# Altium schematic sheet Sensors_Power_Characterisation_Board.SchDoc
size A4; SheetNumber: 1; SheetTotal: 5
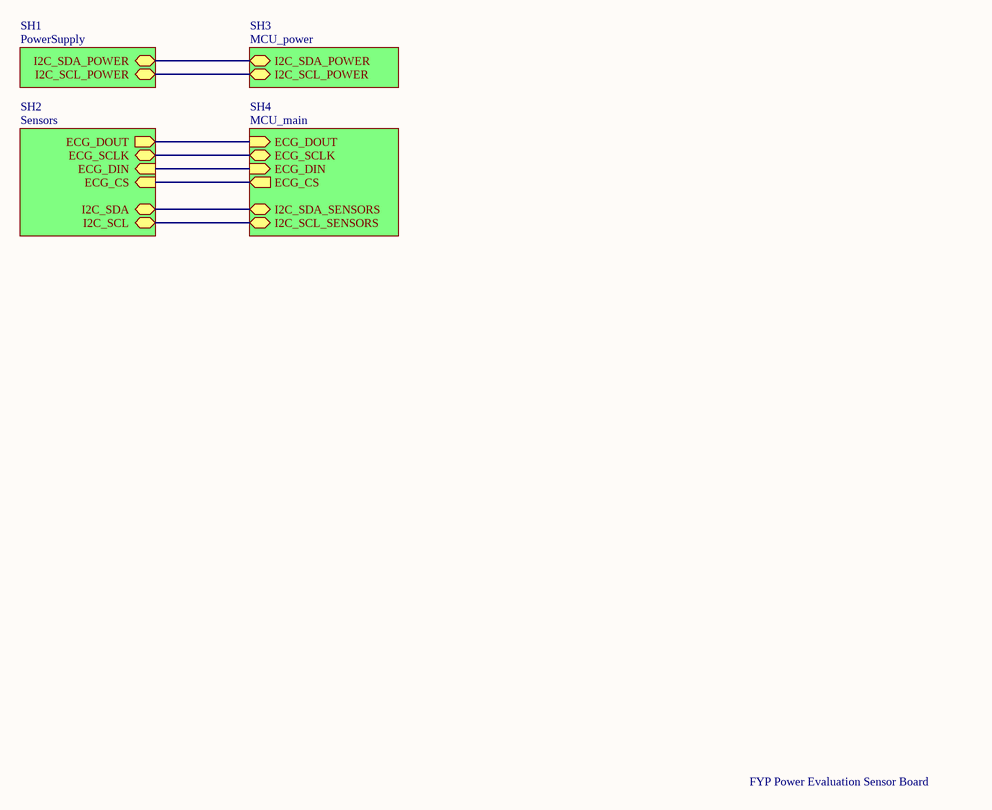
[diagram p0: Sensors_Power_Characterisation_Board.SchDoc]

## Sub-sheets
SH1 = PowerSupply: I2C_SDA_POWER (bidir), I2C_SCL_POWER (bidir)
SH2 = Sensors: ECG_DOUT (out), ECG_SCLK (bidir), ECG_DIN (in), ECG_CS (in), I2C_SCL (bidir), I2C_SDA (bidir)
SH3 = MCU_power: I2C_SDA_POWER (bidir), I2C_SCL_POWER (bidir)
SH4 = MCU_main: ECG_DIN (in), ECG_CS (out), ECG_SCLK (bidir), I2C_SDA_SENSORS (bidir), I2C_SCL_SENSORS (bidir), ECG_DOUT (in)

## Nets
(unnamed): sheet SH1/I2C_SDA_POWER, sheet SH3/I2C_SDA_POWER
(unnamed): sheet SH1/I2C_SCL_POWER, sheet SH3/I2C_SCL_POWER
(unnamed): sheet SH2/ECG_DOUT, sheet SH4/ECG_DOUT
(unnamed): sheet SH2/ECG_SCLK, sheet SH4/ECG_SCLK
(unnamed): sheet SH2/ECG_DIN, sheet SH4/ECG_DIN
(unnamed): sheet SH2/ECG_CS, sheet SH4/ECG_CS
(unnamed): sheet SH2/I2C_SCL, sheet SH4/I2C_SCL_SENSORS
(unnamed): sheet SH2/I2C_SDA, sheet SH4/I2C_SDA_SENSORS

## Notes on the sheet
- FYP Power Evaluation Sensor Board